# Altium project emoe_dds_controller.PrjPcb
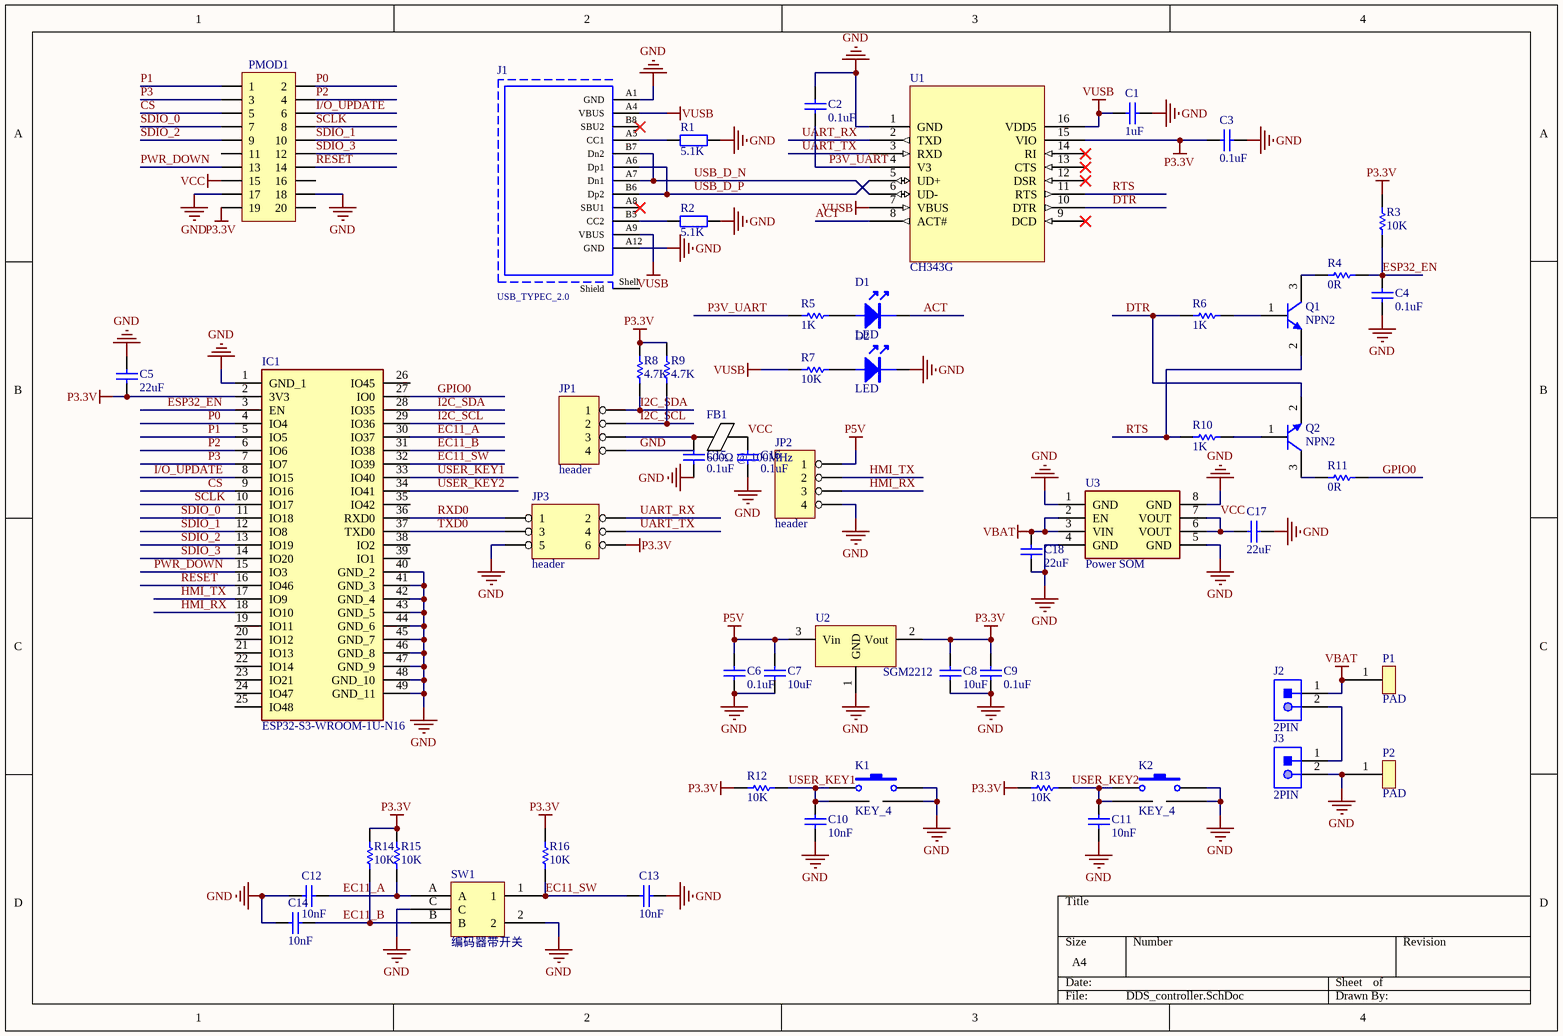
[diagram p0: DDS_controller.SchDoc]
1 sheet, 55 parts. Net scope: global (net labels, ports and power ports of the same name join across sheets).
Board file: DDS_controller.PcbDoc

## Sheet DDS_controller.SchDoc
size A4; SheetNumber: 1; SheetTotal: 1

### Parts
C1  1uF  [0402L]
C2  0.1uF  [0402L]
C3  0.1uF  [0402L]
C4  0.1uF  [0402L]
C5  22uF  [0805]
C6  0.1uF  [0402L]
C7  10uF  [0805]
C8  10uF  [0805]
C9  0.1uF  [0402L]
C10  10nF  [0402L]
C11  10nF  [0402L]
C12  10nF  [0402L]
C13  10nF  [0402L]
C14  10nF  [0402L]
C15  0.1uF  [0603_C]
C16  0.1uF  [0603_C]
C17  22uF  [0805]
C18  22uF  [0805]
D1  LED  [0603_LED]
D2  LED  [0603_LED]
FB1  600Ω @ 100MHz  [0805]
IC1  ESP32-S3-WROOM-1U-N16  [ESP32S3WROOM1UN16]
J1  USB_TYPEC_2.0  [USB_TYPEC_2.0_Horizontal_SMT]
J2  2PIN  [XH2.54-LI-2P]
J3  2PIN  [XH2.54-LI-2P]
JP1  header  [header4]
JP2  header  [header4]
JP3  header  [header2X3]
K1  KEY_4  [KEY5*5]
K2  KEY_4  [KEY5*5]
P1  PAD  [PAD]
P2  PAD  [PAD]
PMOD1  Header 2X10  [header2X10]  (value not drawn)
Q1  NPN2  [SOT-23-3]
Q2  NPN2  [SOT-23-3]
R1  value 5.1K  [R0402]  (hidden comment: Res)
R2  value 5.1K  [R0402]  (hidden comment: Res)
R3  10K  [0402L]
R4  0R  [0402L]
R5  1K  [0402L]
R6  1K  [0402L]
R7  10K  [0402L]
R8  4.7K  [0402L]
R9  4.7K  [0402L]
R10  1K  [0402L]
R11  0R  [0402L]
R12  10K  [0402L]
R13  10K  [0402L]
R14  10K  [0402L]
R15  10K  [0402L]
R16  10K  [0402L]
SW1  编码器带开关  [EC11]
U1  CH343G  [SOP16]
U2  SGM2212  [SOT-223]
U3  Power SOM  [7A8300]

### Nets
GND: C1.1 C2.2 C3.2 C4.1 C5.2 C6.1 C7.1 C8.1 C9.1 C10.1 C11.1 C12.1 C13.1 C14.1 C15.1 C16.1 C17.1 C18.2 D2.1(K) IC1.1(GND_1) IC1.40(GND_2) IC1.41(GND_3) IC1.42(GND_4) IC1.43(GND_5) IC1.44(GND_6) IC1.45(GND_7) IC1.46(GND_8) IC1.47(GND_9) IC1.48(GND_10) IC1.49(GND_11) J1.A1(GND) J1.A12(GND) J3.2 JP1.4 JP2.4 JP3.5 K1.2 K1.3 K2.2 K2.3 P2.1 PMOD1.17 PMOD1.18 R1.2 R2.2 SW1.2 SW1.C U1.1(GND) U2.1(GND) U3.1(GND) U3.4(GND) U3.5(GND) U3.8(GND)
P3.3V: C3.1 C5.1 C8.2 C9.2 IC1.2(3V3) JP3.6 PMOD1.19 R3.2 R8.2 R9.2 R12.2 R13.2 R14.2 R15.2 R16.2 U1.15(VIO) U2.2(Vout)
P5V: C6.2 C7.2 JP2.1 U2.3(Vin)
VBAT: C18.1 J2.1 P1.1 U3.2(EN) U3.3(VIN)
VCC: C16.2 C17.2 FB1.2 PMOD1.15 U3.6(VOUT) U3.7(VOUT)
VUSB: C1.2 J1.A4(VBUS) J1.A9(VBUS) R7.1 U1.7(VBUS) U1.16(VDD5)
ACT: D1.1(K) U1.8(ACT#)
CS: IC1.9(IO16) PMOD1.5
DTR: Q2.2(E) R6.1 U1.10(DTR)
EC11_A: C12.2 IC1.30(IO37) R15.1 SW1.A
EC11_B: C14.2 IC1.31(IO38) R14.1 SW1.B
EC11_SW: C13.2 IC1.32(IO39) R16.1 SW1.1
ESP32_EN: C4.2 IC1.3(EN) R3.1 R4.2
GPIO0: IC1.27(IO0) R11.2
HMI_RX: IC1.18(IO10) JP2.3
HMI_TX: IC1.17(IO9) JP2.2
I2C_SCL: IC1.29(IO36) JP1.2 R9.1
I2C_SDA: IC1.28(IO35) JP1.1 R8.1
I/O_UPDATE: IC1.8(IO15) PMOD1.6
P0: IC1.4(IO4) PMOD1.2
P1: IC1.5(IO5) PMOD1.1
P2: IC1.6(IO6) PMOD1.4
P3: IC1.7(IO7) PMOD1.3
P3V_UART: C2.1 R5.1 U1.4(V3)
PWR_DOWN: IC1.15(IO3) PMOD1.13
RESET: IC1.16(IO46) PMOD1.14
RTS: Q1.2(E) R10.1 U1.11(RTS)
RXD0: IC1.36(RXD0) JP3.1
SCLK: IC1.10(IO17) PMOD1.8
SDIO_0: IC1.11(IO18) PMOD1.7
SDIO_1: IC1.12(IO8) PMOD1.10
SDIO_2: IC1.13(IO19) PMOD1.9
SDIO_3: IC1.14(IO20) PMOD1.12
TXD0: IC1.37(TXD0) JP3.3
UART_RX: JP3.2 U1.2(TXD)
UART_TX: JP3.4 U1.3(RXD)
USB_D_N: J1.A7(Dn1) J1.B7(Dn2) U1.6(UD-)
USB_D_P: J1.A6(Dp1) J1.B6(Dp2) U1.5(UD+)
USER_KEY1: C10.2 IC1.33(IO40) K1.1 K1.4 R12.1
USER_KEY2: C11.2 IC1.34(IO41) K2.1 K2.4 R13.1
NetC15_2: C15.2 FB1.1 JP1.3
NetD1_2: D1.2(A) R5.2
NetD2_2: D2.2(A) R7.2
NetJ1_A5: J1.A5(CC1) R1.1
NetJ1_B5: J1.B5(CC2) R2.1
NetJ2_2: J2.2 J3.1
NetQ1_1: Q1.1(B) R6.2
NetQ1_3: Q1.3(C) R4.1
NetQ2_1: Q2.1(B) R10.2
NetQ2_3: Q2.3(C) R11.1

Not connected (* = marked no-connect by the designer): IC1 19(IO11) 20(IO12) 21(IO13) 22(IO14) 23(IO21) 24(IO47) 25(IO48) 26(IO45) 35(IO42) 38(IO2) 39(IO1); J1 A8(SBU1)* B8(SBU2)* Shell(Shield); PMOD1 11 16 20; U1 9(DCD)* 12(DSR)* 13(CTS)* 14(RI)*

### Library data of the parts
C1-C18 = CAP: Capacitor; Value: 104; Published: 8-Jun-2000; LatestRevisionDate: 17-Jul-2002; LatestRevisionNote: Re-released for DXP Platform.; PackageReference: RAD-0.3; Publisher: Altium Limited
D1 D2 = LED: LED 发光二极管
FB1 = FB: 磁珠 600Ω @ 100MHz
IC1 = ESP32-S3-WROOM-1U-N16: Integrated Circuit; Manufacturer_Name: Espressif Systems; Datasheet Link: https://www.espressif.com/sites/default/files/documentation/esp32-s3-wroom-1_wroom-1u_datasheet_en.pdf; Height: 3.35mm; Manufacturer_Part_Number: ESP32-S3-WROOM-1U-N16; Mouser Part Number: 356-ESP32S3WROM1UN16; Mouser Price/Stock: https://www.mouser.co.uk/ProductDetail/Espressif-Systems/ESP32-S3-WROOM-1U-N16?qs=Li%252BoUPsLEntAI1ynUyotnA%3D%3D
J1 = USB_TYPEC_2.0: USB 3.1 Type C Receptacle WR-COM, Horizontal, SMT / THT; Part Number: 632723300011; Rated Current: 5 A; Contact Resistance: 30 mOhm; Working Voltage: 20 VDC; ComponentLink1Description: Manufacturer; ComponentLink1URL: http://www.we-online.de; ComponentLink2Description: Datasheet; ComponentLink2URL: https://katalog.we-online.de/em/datasheet/632723x00011%282%29.pdf; Published Date: September 2018; Publisher: Wurth Elektronik; Orientation: Horizontal; Connector Type: USB 3.1 Type C; Operating Temperature: -40 to 105 degC; Mounting Technology: SMT / THT; Gender: Receptacle; Packaging: Tape and Reel
J2 J3 = HEADER 2PIN
JP1 JP2 = HEADER 4
JP3 = HEADER 3X2
K1 K2 = KEY_4: Switch; Published: 24-Mar-1999; LatestRevisionDate: 17-Jul-2002; LatestRevisionNote: Re-released for DXP Platform.; PackageReference: SPST-2; Publisher: Altium Limited
PMOD1 = Header 10X2: 10*2P接插件; 淘宝ID: 小糖豆的小窝窝; BOM名称: 10*2P接插件; 下单链接: https://item.taobao.com/item.htm?ft=t&id=613637044352
Q1 Q2 = NPN2: 贴片
R1 R2 = Res: Resistor; Published: 8-Jun-2000; LatestRevisionDate: 29-May-2009; LatestRevisionNote: IPC-7351 Footprint Added.; PackageReference: J1-0603; Publisher: Altium Limited; PackageDescription: Chip Resistor
R3 R4 R7-R9 R11-R16 = RES: Resistor; Value: 1K; Published: 8-Jun-2000; Revision: July-2002: Re-released for DXP Platform.; Publisher: Altium Limited
R5 R6 R10 = RES: Resistor; Published: 8-Jun-2000; Revision: July-2002: Re-released for DXP Platform.; Publisher: Altium Limited; Value: 1K
SW1 = EC11
U1 = CH343G: USB to high speed enhanced TTL Serial / UART
U2 = AMS1117: 3.3V电压转换器AMS1117
U3 = TPS7A8300